# EAGLE design PCBV3 (EAGLE 9.7.0)
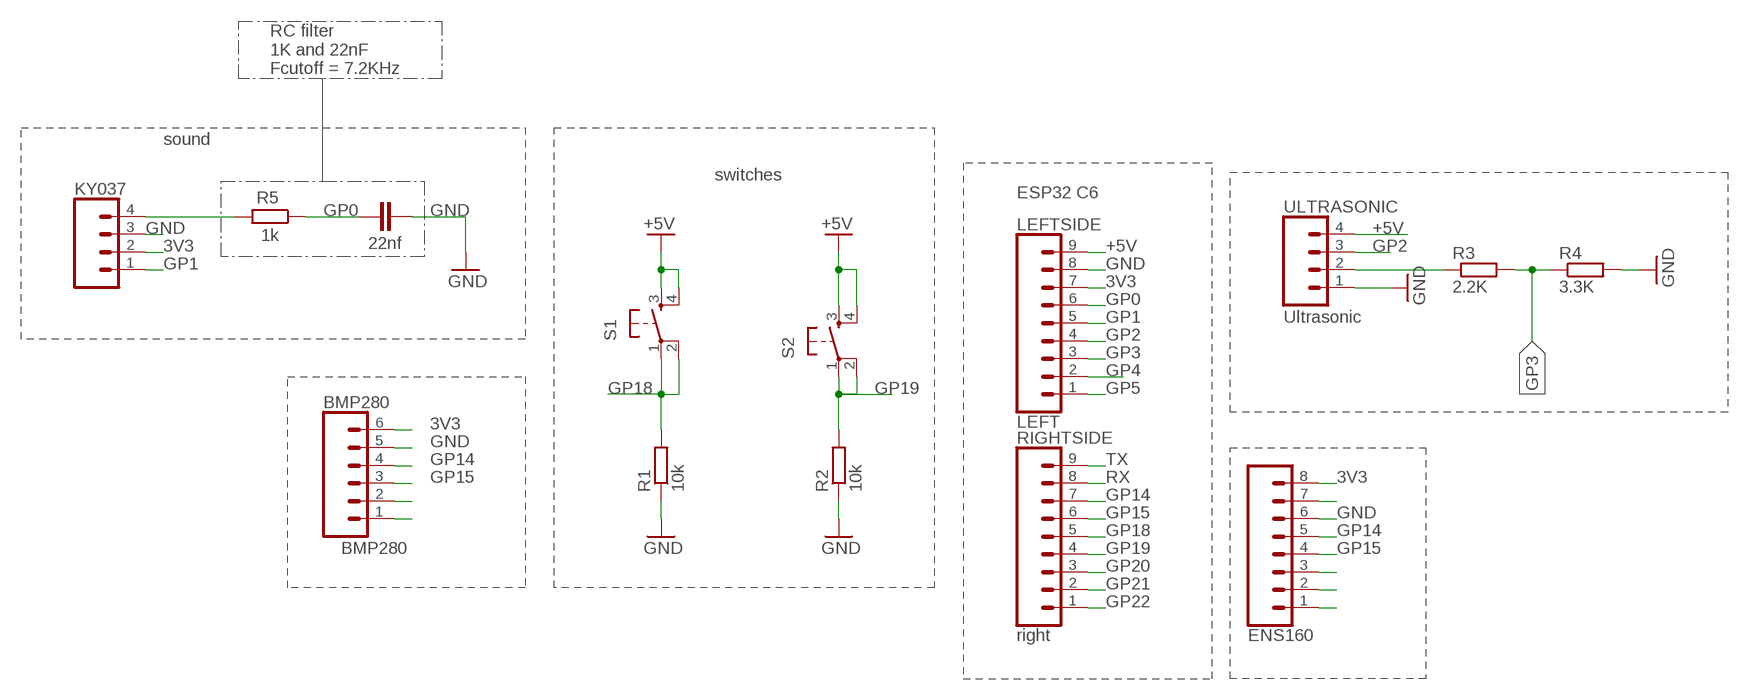
[diagram p0: schematic, sheet 1]

## Parts
BMP280  BMP280  SPARKFUN-CONNECTORS_CONN_06LONGPADS  [SPARKFUN-CONNECTORS_1X06_LONGPADS]
C1  22nf  CAPACITOR-WIMA_C2.5/2  [CAPACITOR-WIMA_C2.5-2]
J3  ENS160  CONN_08"  [1X08]
KY037  1X04_SMD_STRAIGHT_COMBO  CONN_04LONGPADS  [1X04_LONGPADS]
LEFTSIDE  LEFT  CONN_09  [1X09]
R1  10k  R-EU_0207/10  [0207/10]
R2  10k  R-EU_0207/10  [0207/10]
R3  2.2K  R-EU_0207/10  [0207/10]
R4  3.3K  R-EU_0207/10  [0207/10]
R5  1k  R-EU_0207/10  [0207/10]
RIGHTSIDE  right  CONN_09  [1X09]
S1  EL311-ROBOT_SPARKFUN-ELECTROMECHANICAL_TAC_SWITCHPTH  [EL311-ROBOT_SPARKFUN-ELECTROMECHANICAL_TACTILE-PTH]
S2  EL311-ROBOT_SPARKFUN-ELECTROMECHANICAL_TAC_SWITCHPTH  [EL311-ROBOT_SPARKFUN-ELECTROMECHANICAL_TACTILE-PTH]
ULTRASONIC  1X04_SMD_STRAIGHT_COMBO  CONN_04LONGPADS  [1X04_LONGPADS]

## Nets
3V3 [power]: BMP280.6 J3.8 KY037.2 LEFTSIDE.7
+5V [power]: LEFTSIDE.9 S1.3 S1.4 S2.3 S2.4 ULTRASONIC.4
GND [power]: BMP280.5 C1.2 J3.6 KY037.3 LEFTSIDE.8 R1.1 R2.1 R4.2 ULTRASONIC.1
GP0: C1.1 LEFTSIDE.6 R5.1
GP1: KY037.1 LEFTSIDE.5
GP2: LEFTSIDE.4 ULTRASONIC.3
GP3: LEFTSIDE.3 R3.2 R4.1
GP4: LEFTSIDE.2
GP5: LEFTSIDE.1
GP14: BMP280.4 J3.5 RIGHTSIDE.7
GP15: BMP280.3 J3.4 RIGHTSIDE.6
GP18: R1.2 RIGHTSIDE.5 S1.1 S1.2
GP19: R2.2 RIGHTSIDE.4 S2.1 S2.2
GP20: RIGHTSIDE.3
GP21: RIGHTSIDE.2
GP22: RIGHTSIDE.1
N$3: J3.7
N$6: BMP280.2
N$7: BMP280.1
N$8: KY037.4 R5.2
N$9: J3.3
N$10: J3.2
N$11: J3.1
N$12: R3.1 ULTRASONIC.2
RX: RIGHTSIDE.8
TX: RIGHTSIDE.9

## Notes on the sheet
- RC filter
  1K and 22nF
  Fcutoff = 7.2KHz
- sound
- switches
- ESP32 C6
- Ultrasonic
- BMP280

## Library data of the parts
BMP280 = EENG3110 V1 Library:SPARKFUN-CONNECTORS_CONN_06: Multi connection point. Often used as Generic Header-pin footprint for 0.1 inch spaced/style header connections On any of the 0.1 inch spaced packages, you can populate with these: Break Away Headers - Straight <https://www.sparkfun.com/products/116> (PRT-00116) Break Away Male Headers - Right Angle <https://www.sparkfun.com/products/553> (PRT-00553) Female Headers <https://www.sparkfun.com/products/115> (PRT-00115) Break Away Headers - Machine Pin <https://www.sparkfun.com/products/117> (PRT-00117) Break Away Female Headers - Swiss Machine Pin <https://www.sparkfun.com/products/743> (PRT-00743) Arduino Stackable Header - 6 Pin <https://www.sparkfun.com/products/9280> (PRT-09280) For SCREWTERMINALS and SPRING TERMINALS visit here: Screw Terimnals on SparkFun.com <https://www.sparkfun.com/search/results?term=Screw+Terminals> (5mm/3.5mm/2.54mm spacing) This device is also useful as a general connection point to wire up your design to another part of your project. Our various solder wires solder well into these plated through hole pads. Hook-Up Wire - Assortment (Stranded, 22 AWG) <https://www.sparkfun.com/products/11375> (PRT-11375) Hook-Up Wire - Assortment (Solid Core, 22 AWG) <https://www.sparkfun.com/products/11367> (PRT-11367) View the entire wire category on our website here <https://www.sparkfun.com/categories/141>; PROD_ID: CONN-11293; SF_ID: GPS-00579; VALUE: RA 6Pin SMD
C1 = EENG3110 V1 Library:CAPACITOR-WIMA_C: CAPACITOR naming: grid - package width
J3 = EENG3110 V1 Library:CONN_08: Multi connection point. Often used as Generic Header-pin footprint for 0.1 inch spaced/style header connections On any of the 0.1 inch spaced packages, you can populate with these: Break Away Headers - Straight <https://www.sparkfun.com/products/116> (PRT-00116) Break Away Male Headers - Right Angle <https://www.sparkfun.com/products/553> (PRT-00553) Female Headers <https://www.sparkfun.com/products/115> (PRT-00115) Break Away Headers - Machine Pin <https://www.sparkfun.com/products/117> (PRT-00117) Break Away Female Headers - Swiss Machine Pin <https://www.sparkfun.com/products/743> (PRT-00743) Arduino Stackable Header - 8 Pin <https://www.sparkfun.com/products/9279> (PRT-09279) For SCREWTERMINALS and SPRING TERMINALS visit here: Screw Terimnals on SparkFun.com <https://www.sparkfun.com/search/results?term=Screw+Terminals> (5mm/3.5mm/2.54mm spacing) This device is also useful as a general connection point to wire up your design to another part of your project. Our various solder wires solder well into these plated through hole pads. Hook-Up Wire - Assortment (Stranded, 22 AWG) <https://www.sparkfun.com/products/11375> (PRT-11375) Hook-Up Wire - Assortment (Solid Core, 22 AWG) <https://www.sparkfun.com/products/11367> (PRT-11367) View the entire wire category on our website here <https://www.sparkfun.com/categories/141> Special notes: Molex polarized connector foot print use with SKU : PRT-08231 with associated crimp pins and housings. 1MM SMD Version SKU: PRT-10208 NOTES ON THE VARIANTS LOCK and LOCK_LONGPADS... This footprint was designed to help hold the alignment of a through-hole component (i.e. 6-pin header) while soldering it into place. You may notice that each hole has been shifted either up or down by 0.005 of an inch from it's more standard position (which is a perfectly straight line). This slight alteration caused the pins (the squares in the middle) to touch the edges of the holes. Because they are alternating, it causes a "brace" to hold the component in place. 0.005 has proven to be the perfect amount of "off-center" position when using our standard breakaway headers. Although looks a little odd when you look at the bare footprint, once you have a header in there, the alteration is very hard to notice. Also,if you push a header all the way into place, it is covered up entirely on the bottom side.; PROD_ID: CONN-10204; SF_ID: PRT-11543
KY037 ULTRASONIC = EENG3110 V1 Library:CONN_04: Multi connection point. Often used as Generic Header-pin footprint for 0.1 inch spaced/style header connections On any of the 0.1 inch spaced packages, you can populate with these: Break Away Headers - Straight <https://www.sparkfun.com/products/116> (PRT-00116) Break Away Male Headers - Right Angle <https://www.sparkfun.com/products/553> (PRT-00553) Female Headers <https://www.sparkfun.com/products/115> (PRT-00115) Break Away Headers - Machine Pin <https://www.sparkfun.com/products/117> (PRT-00117) Break Away Female Headers - Swiss Machine Pin <https://www.sparkfun.com/products/743> (PRT-00743) For SCREWTERMINALS and SPRING TERMINALS visit here: Screw Terimnals on SparkFun.com <https://www.sparkfun.com/search/results?term=Screw+Terminals> (5mm/3.5mm/2.54mm spacing) This device is also useful as a general connection point to wire up your design to another part of your project. Our various solder wires solder well into these plated through hole pads. Hook-Up Wire - Assortment (Stranded, 22 AWG) <https://www.sparkfun.com/products/11375> (PRT-11375) Hook-Up Wire - Assortment (Solid Core, 22 AWG) <https://www.sparkfun.com/products/11367> (PRT-11367) View the entire wire category on our website here <https://www.sparkfun.com/categories/141> Special notes: Molex polarized connector foot print use with SKU : PRT-08231 with associated crimp pins and housings. 1MM SMD Version SKU: PRT-10208; PROD_ID: CONN-08511; SF_ID: PRT-12638
LEFTSIDE RIGHTSIDE = SparkFun-Connectors:CONN_09: Multi connection point. Often used as Generic Header-pin footprint for 0.1 inch spaced/style header connections On any of the 0.1 inch spaced packages, you can populate with these: Break Away Headers - Straight <https://www.sparkfun.com/products/116> (PRT-00116) Break Away Male Headers - Right Angle <https://www.sparkfun.com/products/553> (PRT-00553) Female Headers <https://www.sparkfun.com/products/115> (PRT-00115) Break Away Headers - Machine Pin <https://www.sparkfun.com/products/117> (PRT-00117) Break Away Female Headers - Swiss Machine Pin <https://www.sparkfun.com/products/743> (PRT-00743) For SCREWTERMINALS and SPRING TERMINALS visit here: Screw Terimnals on SparkFun.com <https://www.sparkfun.com/search/results?term=Screw+Terminals> (5mm/3.5mm/2.54mm spacing) This device is also useful as a general connection point to wire up your design to another part of your project. Our various solder wires solder well into these plated through hole pads. Hook-Up Wire - Assortment (Stranded, 22 AWG) <https://www.sparkfun.com/products/11375> (PRT-11375) Hook-Up Wire - Assortment (Solid Core, 22 AWG) <https://www.sparkfun.com/products/11367> (PRT-11367) View the entire wire category on our website here <https://www.sparkfun.com/categories/141> Special notes: Molex polarized connector foot print use with SKU : PRT-08231 with associated crimp pins and housings. 1MM SMD Version SKU: PRT-10208 NOTES ON THE VARIANTS LOCK and LOCK_LONGPADS... This footprint was designed to help hold the alignment of a through-hole component (i.e. 6-pin header) while soldering it into place. You may notice that each hole has been shifted either up or down by 0.005 of an inch from it's more standard position (which is a perfectly straight line). This slight alteration caused the pins (the squares in the middle) to touch the edges of the holes. Because they are alternating, it causes a "brace" to hold the component in place. 0.005 has proven to be the perfect amount of "off-center" position when using our standard breakaway headers. Although looks a little odd when you look at the bare footprint, once you have a header in there, the alteration is very hard to notice. Also,if you push a header all the way into place, it is covered up entirely on the bottom side.
R1-R5 = EENG3110 V1 Library:R-EU_: RESISTOR, European symbol
S1 S2 = EENG3110 V1 Library:EL311-ROBOT_SPARKFUN-ELECTROMECHANICAL_TAC_SWITCH: Momentary Switch Button commonly used for reset or general input. Spark Fun Electronics SKU : COM-00097 SMT- SWCH-08247

## Net classes
1 power: width 1.27 mm

## Board
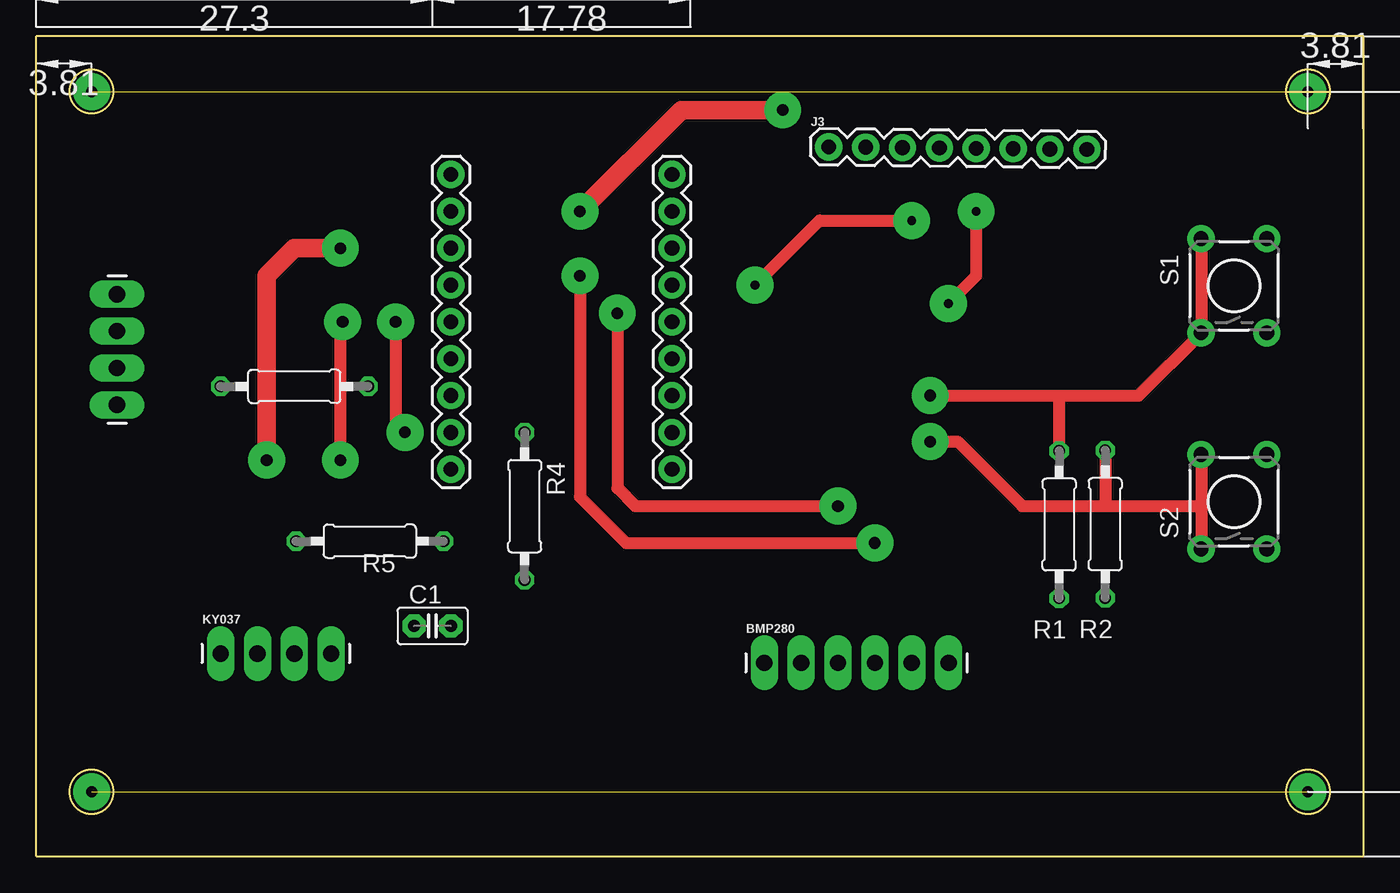
[diagram p1: board, top side]
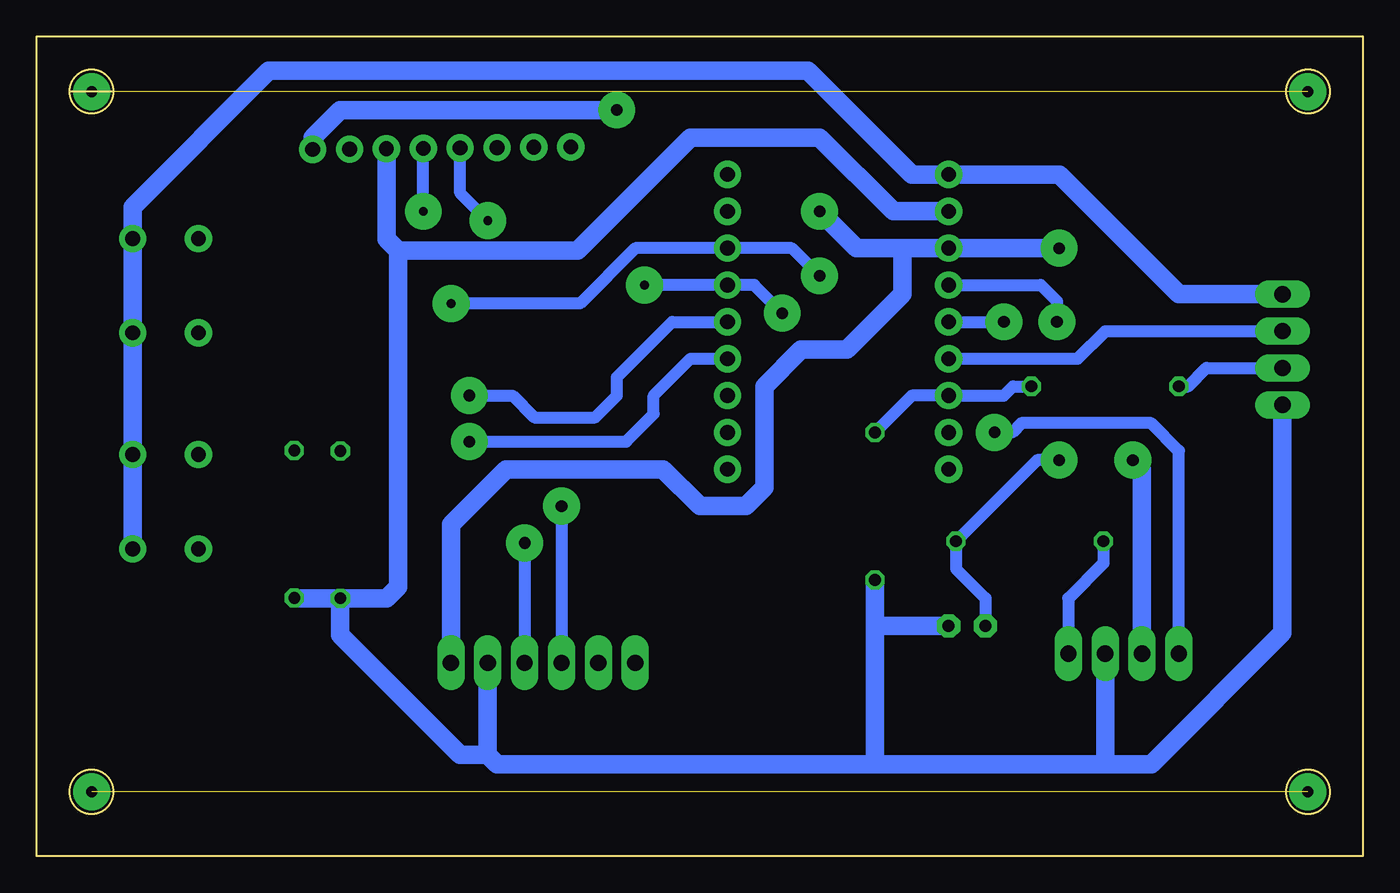
[diagram p2: board, bottom side, seen from below]

Size 91.44 x 56.52 mm. Coordinates in mm from the lower left corner, seen from the top.
Outline: 0,0 0,56.52 91.44,56.52 91.44,0 0,0
Copper layers (1*16): Top 0.035mm / dielectric 1.5mm / Bottom 0.035mm
Design rules "Fusion Electronics Design Rules": minimum track width 32mil, minimum drill 24mil, track to track 6mil, track to pad 6mil, pad to pad 6mil, via to via 12mil, smd to smd 6mil, copper to edge 40mil, drill to drill 6mil, minimum pad ring 10mil, minimum via ring 8mil, stop-mask expansion 4mil, vias tented up to drill 9999mil, thermal gap 10mil
Milling: area 86.1,51.2 to 89.1,54.2; area 2.3,51.2 to 5.3,54.2; area 2.3,2.9 to 5.3,5.9; area 86.1,2.9 to 89.1,5.9; 1 lines

### Footprints (pad centres in the part's own frame; a part is rotated, then mirrored left to right if it is on the bottom)
SPARKFUN-CONNECTORS_1X06_LONGPADS = drill 1.118 pad 1.88 long: 1 0,0; 2 2.54,0; 3 5.08,0; 4 7.62,0; 5 10.16,0; 6 12.7,0
CAPACITOR-WIMA_C2.5-2 = drill 0.813 pad 1.6 octagon: 1 -1.27,0; 2 1.27,0
1X08 = drill 1.016 pad 1.88: 1 0,0; 2 2.54,0; 3 5.08,0; 4 7.62,0; 5 10.16,0; 6 12.7,0; 7 15.24,0; 8 17.78,0
1X04_LONGPADS = drill 1.118 pad 1.88 long: 1 0,0; 2 2.54,0; 3 5.08,0; 4 7.62,0
1X09 = drill 1.016 pad 1.88: 1 0,0; 2 2.54,0; 3 5.08,0; 4 7.62,0; 5 10.16,0; 6 12.7,0; 7 15.24,0; 8 17.78,0; 9 20.32,0
0207/10 = drill 0.813 octagon: 1 -5.08,0; 2 5.08,0
EL311-ROBOT_SPARKFUN-ELECTROMECHANICAL_TACTILE-PTH = drill 1.016 pad 1.88: 1 -3.251,2.261; 2 3.251,2.261; 3 -3.251,-2.261; 4 3.251,-2.261

### Placement (x,y rotation side)
BMP280  50.16,13.33 0 top
C1  27.3,15.88 0 top
J3  54.61,48.9 359.4 top
KY037  12.7,13.97 0 top
LEFTSIDE  28.57,26.67 90 top
R1  70.48,22.86 90 top
R2  73.66,22.89 90 top
R3  17.78,32.38 0 top
R4  33.66,24.13 270 top
R5  22.98,21.71 180 top
RIGHTSIDE  43.81,26.67 90 top
S1  82.53,39.32 90 top
S2  82.53,24.43 90 top
ULTRASONIC  5.56,31.11 90 top

### Tracks (layer width: path | path; a pad name or v marks a point on that pad's centre or on a via)
3V3  (via drill 0.8 pad 2.54)
  Top 1.27: v20.95,41.91 17.78,41.91 15.88,40 v15.88,27.3 | v37.47,44.45 44.45,51.44 v51.44,51.44
  Bottom 1.27: 31.75,41.91 LEFTSIDE.7 v20.95,41.91 | BMP280.6 62.87,22.86 59.05,26.67 48.26,26.67 45.72,24.13 42.55,24.13 41.27,25.4 41.27,32.38 38.73,34.92 35.56,34.92 31.75,38.73 31.75,41.91 | 31.75,41.91 34.92,41.91 v37.47,44.45 | v51.44,51.44 70.48,51.44 72.39,49.53 J3.8 | v15.88,27.3 15.24,26.67 KY037.2
+5V
  Bottom 1.27: S2.4 84.79,27.3 | 84.79,27.3 S2.3 | ULTRASONIC.4 12.7,38.73 20.95,46.99 LEFTSIDE.9 31.11,46.99 38.25,54.13 75.41,54.13 84.8,44.74 S1.4 S1.3 84.8,32.44 84.81,32.42 84.81,27.33 84.79,27.3
GND
  Bottom 1.27: LEFTSIDE.8 32.38,44.45 37.47,49.53 46.35,49.53 54.13,41.76 66.52,41.76 | R2.1 73.64,17.78 R1.1 | R1.1 67.31,17.78 66.52,18.57 66.52,41.76 | ULTRASONIC.1 5.56,15.39 14.61,6.35 17.78,6.35 | 60.33,6.98 62.23,6.98 70.48,15.24 R1.1 | BMP280.5 60.33,6.98 | 66.52,41.76 67.31,42.54 J3.6 | 17.78,6.35 33.66,6.35 | 17.78,6.35 KY037.3 | 33.66,15.88 33.66,6.35 | 33.66,6.35 59.69,6.35 60.33,6.98 | R4.2 33.66,15.88 | C1.2 33.66,15.88
GP0  (via drill 0.8 pad 2.54)
  Top 0.813: v20.95,27.3 20.95,36.68 v21.11,36.83
  Bottom 0.813: LEFTSIDE.6 22.23,39.37 21.11,38.25 v21.11,36.83 | v20.95,27.3 22.47,27.3 R5.1 28.06,19.81 26.04,17.78 C1.1
GP1  (via drill 0.8 pad 2.54)
  Top 0.813: v24.77,36.83 24.77,29.86 v25.41,29.22
  Bottom 0.813: LEFTSIDE.5 v24.77,36.83 | KY037.1 12.7,27.94 14.61,29.84 23.56,29.84 24.19,29.22 v25.41,29.22
GP2
  Bottom 0.813: LEFTSIDE.4 19.68,34.29 17.78,36.2 ULTRASONIC.3
GP3
  Bottom 0.813: R4.1 31.11,31.75 LEFTSIDE.3 24.77,31.75 24.13,32.38 R3.2
GP14  (via drill 0.61 pad 2.54, 0.8 pad 2.54)
  Top 0.813: v37.47,40 37.47,24.77 40.64,21.59 v57.78,21.59 | v62.87,38.1 64.77,40 v64.77,44.45
  Bottom 0.813: v37.47,40 39.37,41.91 RIGHTSIDE.7 50.16,41.91 53.98,38.1 v62.87,38.1 | v57.78,21.59 BMP280.4 | v64.77,44.45 J3.5
GP15  (via drill 0.61 pad 2.54, 0.8 pad 2.54)
  Top 0.813: v55.24,24.13 41.27,24.13 40.04,25.37 v40.04,37.43 | v49.53,39.37 53.98,43.81 v60.33,43.81
  Bottom 0.813: v55.24,24.13 BMP280.3 | v40.04,37.43 41.98,39.37 RIGHTSIDE.6 v49.53,39.37 | v60.33,43.81 62.23,45.72 J3.4
GP18  (via drill 0.8 pad 2.54)
  Top 0.813: S1.2 S1.1 75.95,31.75 70.48,31.75 | v61.59,31.75 70.48,31.75 | R1.2 70.48,31.75
  Bottom 0.813: v61.59,31.75 58.63,31.75 57.14,30.25 52.93,30.25 51.44,31.75 51.44,33.02 47.62,36.83 RIGHTSIDE.5
GP19  (via drill 0.8 pad 2.54)
  Top 0.813: v61.59,28.57 63.5,28.57 67.94,24.13 73.66,24.13 | R2.2 73.66,24.13 | S2.2 80.27,24.13 | 80.27,24.13 S2.1 | 73.66,24.13 80.27,24.13
  Bottom 0.813: v61.59,28.57 50.8,28.57 48.9,30.48 48.9,31.75 46.35,34.29 RIGHTSIDE.4
N$2  (via drill 0.75 pad 2.54)  (1 unrouted)
  other vias: 87.63,52.7 3.81,52.7
N$8
  Bottom 0.813: R5.2 17.9,20.2 20.32,17.78 KY037.4
N$12
  Bottom 0.813: R3.1 12.06,32.38 10.79,33.66 ULTRASONIC.2
N$13  (via drill 0.75 pad 2.54)  (1 unrouted)
  other vias: 87.63,4.44 3.81,4.44